# Altium schematic sheet [7]DAC_and_MIC.SchDoc
size A3; DocumentNumber: 7; SheetNumber: 7; SheetTotal: 11
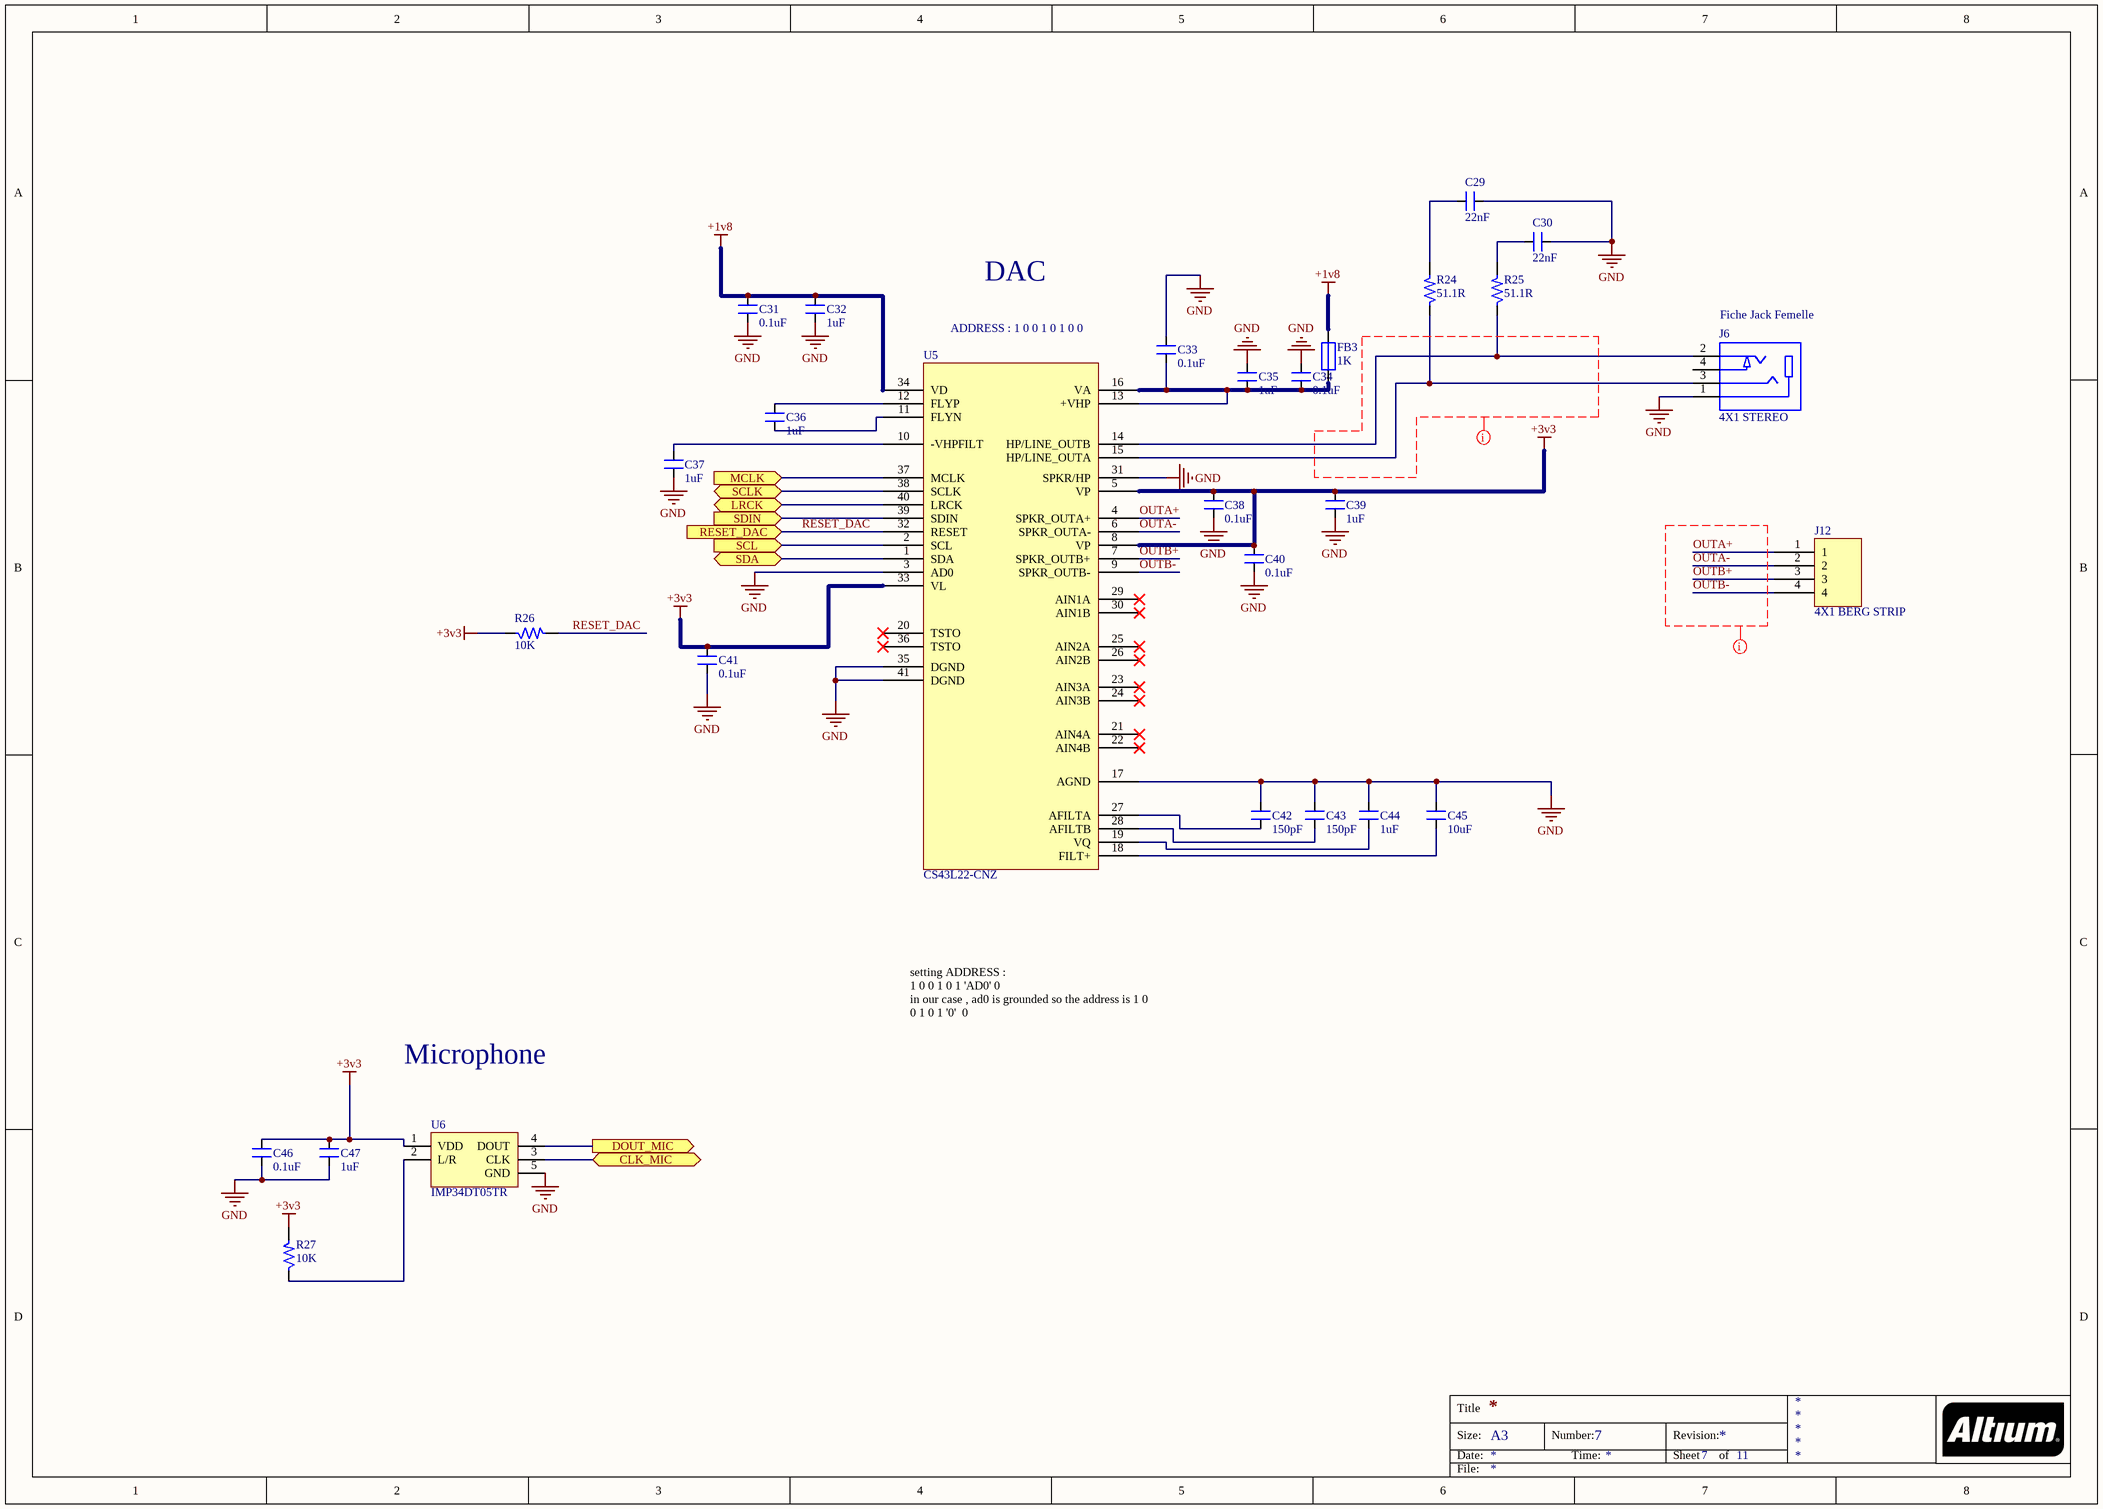
[diagram p0: [7]DAC_and_MIC.SchDoc]

## Parts
C29  22nF  [CAP_0805]
C30  22nF  [CAP_0805]
C31  0.1uF  [CAP_0805]
C32  1uF  [CAP_0805]
C33  0.1uF  [CAP_0805]
C34  0.1uF  [CAP_0805]
C35  1uF  [CAP_0805]
C36  1uF  [CAP_0805]
C37  1uF  [CAP_0805]
C38  0.1uF  [CAP_0805]
C39  1uF  [CAP_0805]
C40  0.1uF  [CAP_0805]
C41  0.1uF  [CAP_0805]
C42  150pF  [CAP_0805]
C43  150pF  [CAP_0805]
C44  1uF  [CAP_0805]
C45  10uF  [CAP_1206]
C46  0.1uF  [CAP_0805]
C47  1uF  [CAP_0805]
FB3  1K  [IND_0805]
J6  4X1 STEREO  [CON_SJ-2504A-SMT-TR_SMD]
J12  4X1 BERG STRIP  [CON4_100_40D72_TH_ST_MALE]
R24  51.1R  [RES_0603]
R25  51.1R  [RES_0603]
R26  10K  [RES_0603]
R27  10K  [RES_0603]
U5  CS43L22-CNZ  [QFN40_19_284_33X9_SMD]
U6  IMP34DT05TR  [HCLGA-4_53_137_15X37_SMD]

## Ports
CLK_MIC (bidir), DOUT_MIC (out), LRCK (bidir), MCLK (in), RESET_DAC (in), SCL (in), SCLK (bidir), SDA (bidir), SDIN (in)

## Nets
+1v8: C31.2 C32.2 FB3.2 U5.34(VD)
+3v3: C38.2 C39.2 C40.2 C41.2 C46.2 C47.2 R26.1 R27.2 U5.5(VP) U5.8(VP) U5.33(VL) U6.1(VDD)
GND: C29.2 C30.2 C31.1 C32.1 C33.2 C34.1 C35.1 C37.1 C38.1 C39.1 C40.1 C41.1 C42.2 C43.2 C44.2 C45.2 C46.1 C47.1 J6.1 U5.3(AD0) U5.17(AGND) U5.31(SPKR/HP) U5.35(DGND) U5.41(DGND) U6.5(GND)
CLK_MIC: U6.3(CLK) ; port CLK_MIC
DOUT_MIC: U6.4(DOUT) ; port DOUT_MIC
LRCK: U5.40(LRCK) ; port LRCK
MCLK: U5.37(MCLK) ; port MCLK
OUTA+: J12.1 U5.4(SPKR_OUTA+)
OUTA-: J12.2 U5.6(SPKR_OUTA-)
OUTB+: J12.3 U5.7(SPKR_OUTB+)
OUTB-: J12.4 U5.9(SPKR_OUTB-)
RESET_DAC: R26.2 U5.32(RESET) ; port RESET_DAC
SCL: U5.2(SCL) ; port SCL
SCLK: U5.38(SCLK) ; port SCLK
SDA: U5.1(SDA) ; port SDA
SDIN: U5.39(SDIN) ; port SDIN
NetC29_1: C29.1 R24.2
NetC30_1: C30.1 R25.2
NetC33_1: C33.1 C34.2 C35.2 FB3.1 U5.13(+VHP) U5.16(VA)
NetC36_1: C36.1 U5.11(FLYN)
NetC36_2: C36.2 U5.12(FLYP)
NetC37_2: C37.2 U5.10(-VHPFILT)
NetC42_1: C42.1 U5.27(AFILTA)
NetC43_1: C43.1 U5.28(AFILTB)
NetC44_1: C44.1 U5.19(VQ)
NetC45_1: C45.1 U5.18(FILT+)
NetJ6_2: J6.2 R25.1 U5.14(HP/LINE_OUTB)
NetJ6_3: J6.3 R24.1 U5.15(HP/LINE_OUTA)
NetR27_1: R27.1 U6.2(L/R)

Not connected (* = marked no-connect by the designer): J6 4; U5 20(TSTO)* 21(AIN4A)* 22(AIN4B)* 23(AIN3A)* 24(AIN3B)* 25(AIN2A)* 26(AIN2B)* 29(AIN1A)* 30(AIN1B)* 36(TSTO)*

## Layout directives
net class Critical nets: +3v3, OUTA+, OUTA-, OUTB+, OUTB-

## Notes on the sheet
- DAC
- (near J6) Fiche Jack Femelle
- ADDRESS : 1 0 0 1 0 1 0 0
- Microphone
- setting ADDRESS :
  1 0 0 1 0 1 'AD0' 0
  in our case , ad0 is grounded so the address is 1 0 0 1 0 1 '0'  0
- Title
- Size:
- Date:
- A3
- Number:
- Time:
- Revision:
- Sheet
- of
- File:

## Library data of the parts
C29 C30 = CAP_22nF-50V-10%-0805: 0.022µF ±10% 50V Ceramic Capacitor X7R 0805 (2012 Metric) /; Manufacturer: Samsung Electro-Mechanics; Manufacturer Part Number: CL21B223KBANNNC; Alternate Part Number-1: NA; Case/Package: 0805; Supplier-1: Digikey; Supplier Part Number-1: 1276-1081-1-ND - Cut Tape (CT)
C31 C33 C34 C38 C40 C41 C46 = CAP_0.1uF-50V-5%-0805: 0.1µF ±5% 50V Ceramic Capacitor X7R 0805 (2012 Metric) /; Manufacturer: AVX Corporation; Manufacturer Part Number: 08055C104JAT4A; Alternate Part Number-1: 0805B104M500; Case/Package: 0805; Supplier-1: SIRICOM; Supplier Part Number-1: 0805B104J500CT
C32 C35-C37 C39 C44 C47 = CAP_1uF-50V-5%-0805: 1µF ±5% 50V Ceramic Capacitor X7R 0805 (2012 Metric) /; Manufacturer: Samsung; Manufacturer Part Number: CC0805JKX7R9BB105; Alternate Part Number-1: 0805F105M500NT; Case/Package: 0805; Supplier-1: SIRICOM; Supplier Part Number-1: CL21B105KBFNNNE
C42 C43 = CAP_150pF-50V-10%-0805: 150pF ±10% 50V Ceramic Capacitor C0G, NP0 0805 (2012 Metric) /; Manufacturer: AVX Corporation; Manufacturer Part Number: 08055A151KAT2A; Alternate Part Number-1: NA; Case/Package: 0805; Supplier-1: Digikey; Supplier Part Number-1: 478-10501-1-ND - Cut Tape (CT)
C45 = CAP_10uF-50V-10%-1206: 10µF ±10% 50V Ceramic Capacitor X7R 1206 (3216 Metric) /; Manufacturer: KEMET; Manufacturer Part Number: CL31B106KBHNNNE; Alternate Part Number-1: GRT31CR61H106ME01L; Case/Package: 1206; Supplier-1: SIRICOM; Supplier Part Number-1: CC1206KKX5R9BB106
FB3 = FB_1K-100MHZ-1.6A-0805: 1 kOhms @ 100MHz 1 Power Line Ferrite Bead 0805 (2012 Metric) 1.6A; Manufacturer: Laird; Manufacturer Part Number: BLM21SP102SH1D; Alternate Part Number-1: NA; Case/Package: 0805; Supplier-1: SIRICOM; Supplier Part Number-1: ACMS201209A102
J6 = CON-PLG-STEREO_4X1-100-RA-SMD: 2.50mm (0.094", 3/32", Sub Mini, Miniature) - Headphone Phone Jack Stereo (4 Conductor, TRRS) Connector Solder; Manufacturer: CUI Devices; Manufacturer Part Number: SJ-2504A-SMT-TR; Alternate Part Number-1: NA; Case/Package: SMD; Supplier Part Number-1: CP-SJ-2504A-SMT-CT-ND - Cut Tape (CT); Supplier-1: Digikey
J12 = CON-BS-PLG_4X1-100-ST-TH: 4 Pins, 1 Row 2.54mm Pitch, Straight bergstrip, Male; Manufacturer: NA; Manufacturer Part Number: NA; Case/Package: TH-CON; Supplier-1: SP ROAD; Supplier Part Number-1: NA; Alternate Part Number-1: NA
R24 R25 = RES_51.1R-0.1W-1%-0603: 51.1 Ohms ±1% 0.1W, 1/10W Chip Resistor 0603 (1608 Metric) Thick Film /; Manufacturer: Vishay Dale; Manufacturer Part Number: CRCW060351R1FKEAC; Alternate Part Number-1: NA; Case/Package: 0603; Supplier-1: Digikey; Supplier Part Number-1: 541-5468-1-ND - Cut Tape (CT)
R26 R27 = RES_10K-0.1W-1%-0603: 10 kOhms ±1% 0.1W, 1/10W Chip Resistor 0603 (1608 Metric) Automotive AEC-Q200 Thick Film /; Manufacturer: Walsin; Manufacturer Part Number: WR06X1002FTL; Alternate Part Number-1: 0603WAJ0103T5E; Case/Package: 0603; Supplier-1: SIRICOM; Supplier Part Number-1: WR06X1002FTL
U5 = IC_CS43L22: Audio D/A Converter ICs Low Power Stereo DAC w/ClassD Spkr Driver; Manufacturer: Cirrus Logic; Alternate Part Number-1: NA; Manufacturer Part Number: CS43L22-CNZ; Case/Package: QFN-40; Supplier-1: Mouser; Supplier Part Number-1: 777-CS43L22-CNZ
U6 = IC_IMP34DT05TR: MEMS Microphones AUTO & INDUSTRIAL SENSORS; Manufacturer: STMicroelectronics; Alternate Part Number-1: NA; Manufacturer Part Number: IMP34DT05TR; Case/Package: HCLGA-4; Supplier-1: Mouser; Supplier Part Number-1: 511-IMP34DT05TR